# Altium schematic sheet PCB_Interplaque_JetsonV1.SchDoc
size A; SheetNumber: 1; SheetTotal: 1
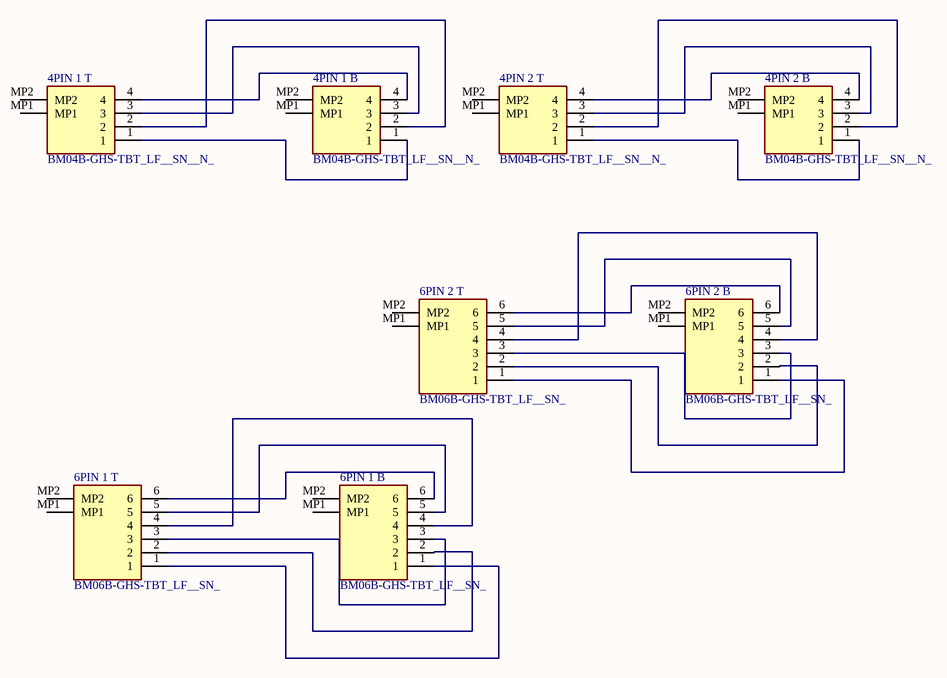
[diagram p0: PCB_Interplaque_JetsonV1.SchDoc]

## Parts
4PIN_1_B  BM04B-GHS-TBT_LF__SN__N_  [BM04BGHSTBTLFSNN]
4PIN_1_T  BM04B-GHS-TBT_LF__SN__N_  [BM04BGHSTBTLFSNN]
4PIN_2_B  BM04B-GHS-TBT_LF__SN__N_  [BM04BGHSTBTLFSNN]
4PIN_2_T  BM04B-GHS-TBT_LF__SN__N_  [BM04BGHSTBTLFSNN]
6PIN_1_B  BM06B-GHS-TBT_LF__SN_  [BM06BGHSTBTLFSN]
6PIN_1_T  BM06B-GHS-TBT_LF__SN_  [BM06BGHSTBTLFSN]
6PIN_2_B  BM06B-GHS-TBT_LF__SN_  [BM06BGHSTBTLFSN]
6PIN_2_T  BM06B-GHS-TBT_LF__SN_  [BM06BGHSTBTLFSN]

## Nets
Net4PIN_1_B_1: 4PIN_1_B.1 4PIN_1_T.1
Net4PIN_1_B_2: 4PIN_1_B.2 4PIN_1_T.2
Net4PIN_1_B_3: 4PIN_1_B.3 4PIN_1_T.3
Net4PIN_1_B_4: 4PIN_1_B.4 4PIN_1_T.4
Net4PIN_2_B_1: 4PIN_2_B.1 4PIN_2_T.1
Net4PIN_2_B_2: 4PIN_2_B.2 4PIN_2_T.2
Net4PIN_2_B_3: 4PIN_2_B.3 4PIN_2_T.3
Net4PIN_2_B_4: 4PIN_2_B.4 4PIN_2_T.4
Net6PIN_1_B_1: 6PIN_1_B.1 6PIN_1_T.1
Net6PIN_1_B_2: 6PIN_1_B.2 6PIN_1_T.2
Net6PIN_1_B_3: 6PIN_1_B.3 6PIN_1_T.3
Net6PIN_1_B_4: 6PIN_1_B.4 6PIN_1_T.4
Net6PIN_1_B_5: 6PIN_1_B.5 6PIN_1_T.5
Net6PIN_1_B_6: 6PIN_1_B.6 6PIN_1_T.6
Net6PIN_2_B_1: 6PIN_2_B.1 6PIN_2_T.1
Net6PIN_2_B_2: 6PIN_2_B.2 6PIN_2_T.2
Net6PIN_2_B_3: 6PIN_2_B.3 6PIN_2_T.3
Net6PIN_2_B_4: 6PIN_2_B.4 6PIN_2_T.4
Net6PIN_2_B_5: 6PIN_2_B.5 6PIN_2_T.5
Net6PIN_2_B_6: 6PIN_2_B.6 6PIN_2_T.6

Not connected (* = marked no-connect by the designer): 4PIN_1_B MP1 MP2; 4PIN_1_T MP1 MP2; 4PIN_2_B MP1 MP2; 4PIN_2_T MP1 MP2; 6PIN_1_B MP1 MP2; 6PIN_1_T MP1 MP2; 6PIN_2_B MP1 MP2; 6PIN_2_T MP1 MP2

## Library data of the parts
4PIN_1_B 4PIN_1_T 4PIN_2_B 4PIN_2_T = BM04B-GHS-TBT_LF__SN__N_: Connector; Manufacturer_Name: JST (JAPAN SOLDERLESS TERMINALS); Manufacturer_Part_Number: BM04B-GHS-TBT(LF)(SN)(N); Datasheet Link: http://www.jst-mfg.com/product/pdf/eng/eGH.pdf; Height: 4.05mm; Mouser Part Number: N/A; Mouser Price/Stock: https://www.mouser.co.uk/ProductDetail/JST-Commercial/BM04B-GHS-TBTLFSNN?qs=QpmGXVUTftGHKxacCgPJ1g%3D%3D; Arrow Part Number: BM04B-GHS-TBT(LF)(SN)(N); Arrow Price/Stock: https://www.arrow.com/en/products/bm04b-ghs-tbt-lf-sn-n/jst-manufacturing?region=europe
6PIN_1_B 6PIN_1_T 6PIN_2_B 6PIN_2_T = BM06B-GHS-TBT_LF__SN_: Connector; Manufacturer_Name: JST (JAPAN SOLDERLESS TERMINALS); Manufacturer_Part_Number: BM06B-GHS-TBT(LF)(SN); Datasheet Link: https://datasheet.lcsc.com/szlcsc/2004111131_JST-Sales-America-BM06B-GHS-TBT-LF-SN_C495534.pdf; Height: 4.05mm; Mouser Part Number: 306-BM06BGHSTBTLFSNN; Mouser Price/Stock: https://www.mouser.co.uk/ProductDetail/JST-Commercial/BM06B-GHS-TBTLFSN?qs=cdbOS8ANM9CObKjnhD04mw%3D%3D